# EasyEDA Pro project ProPrj_HPMDuino_DEV_2025-07-16.epro, schematic Schematic2
Board Name: JTAG转接板; Create Date: 2025-07-07; Page Name: P1; Project Name: HPMDuino_DEV; Schematic Name: Schematic2; Update Date: 2025-07-07; Drawed: Flose; Version: 1.0
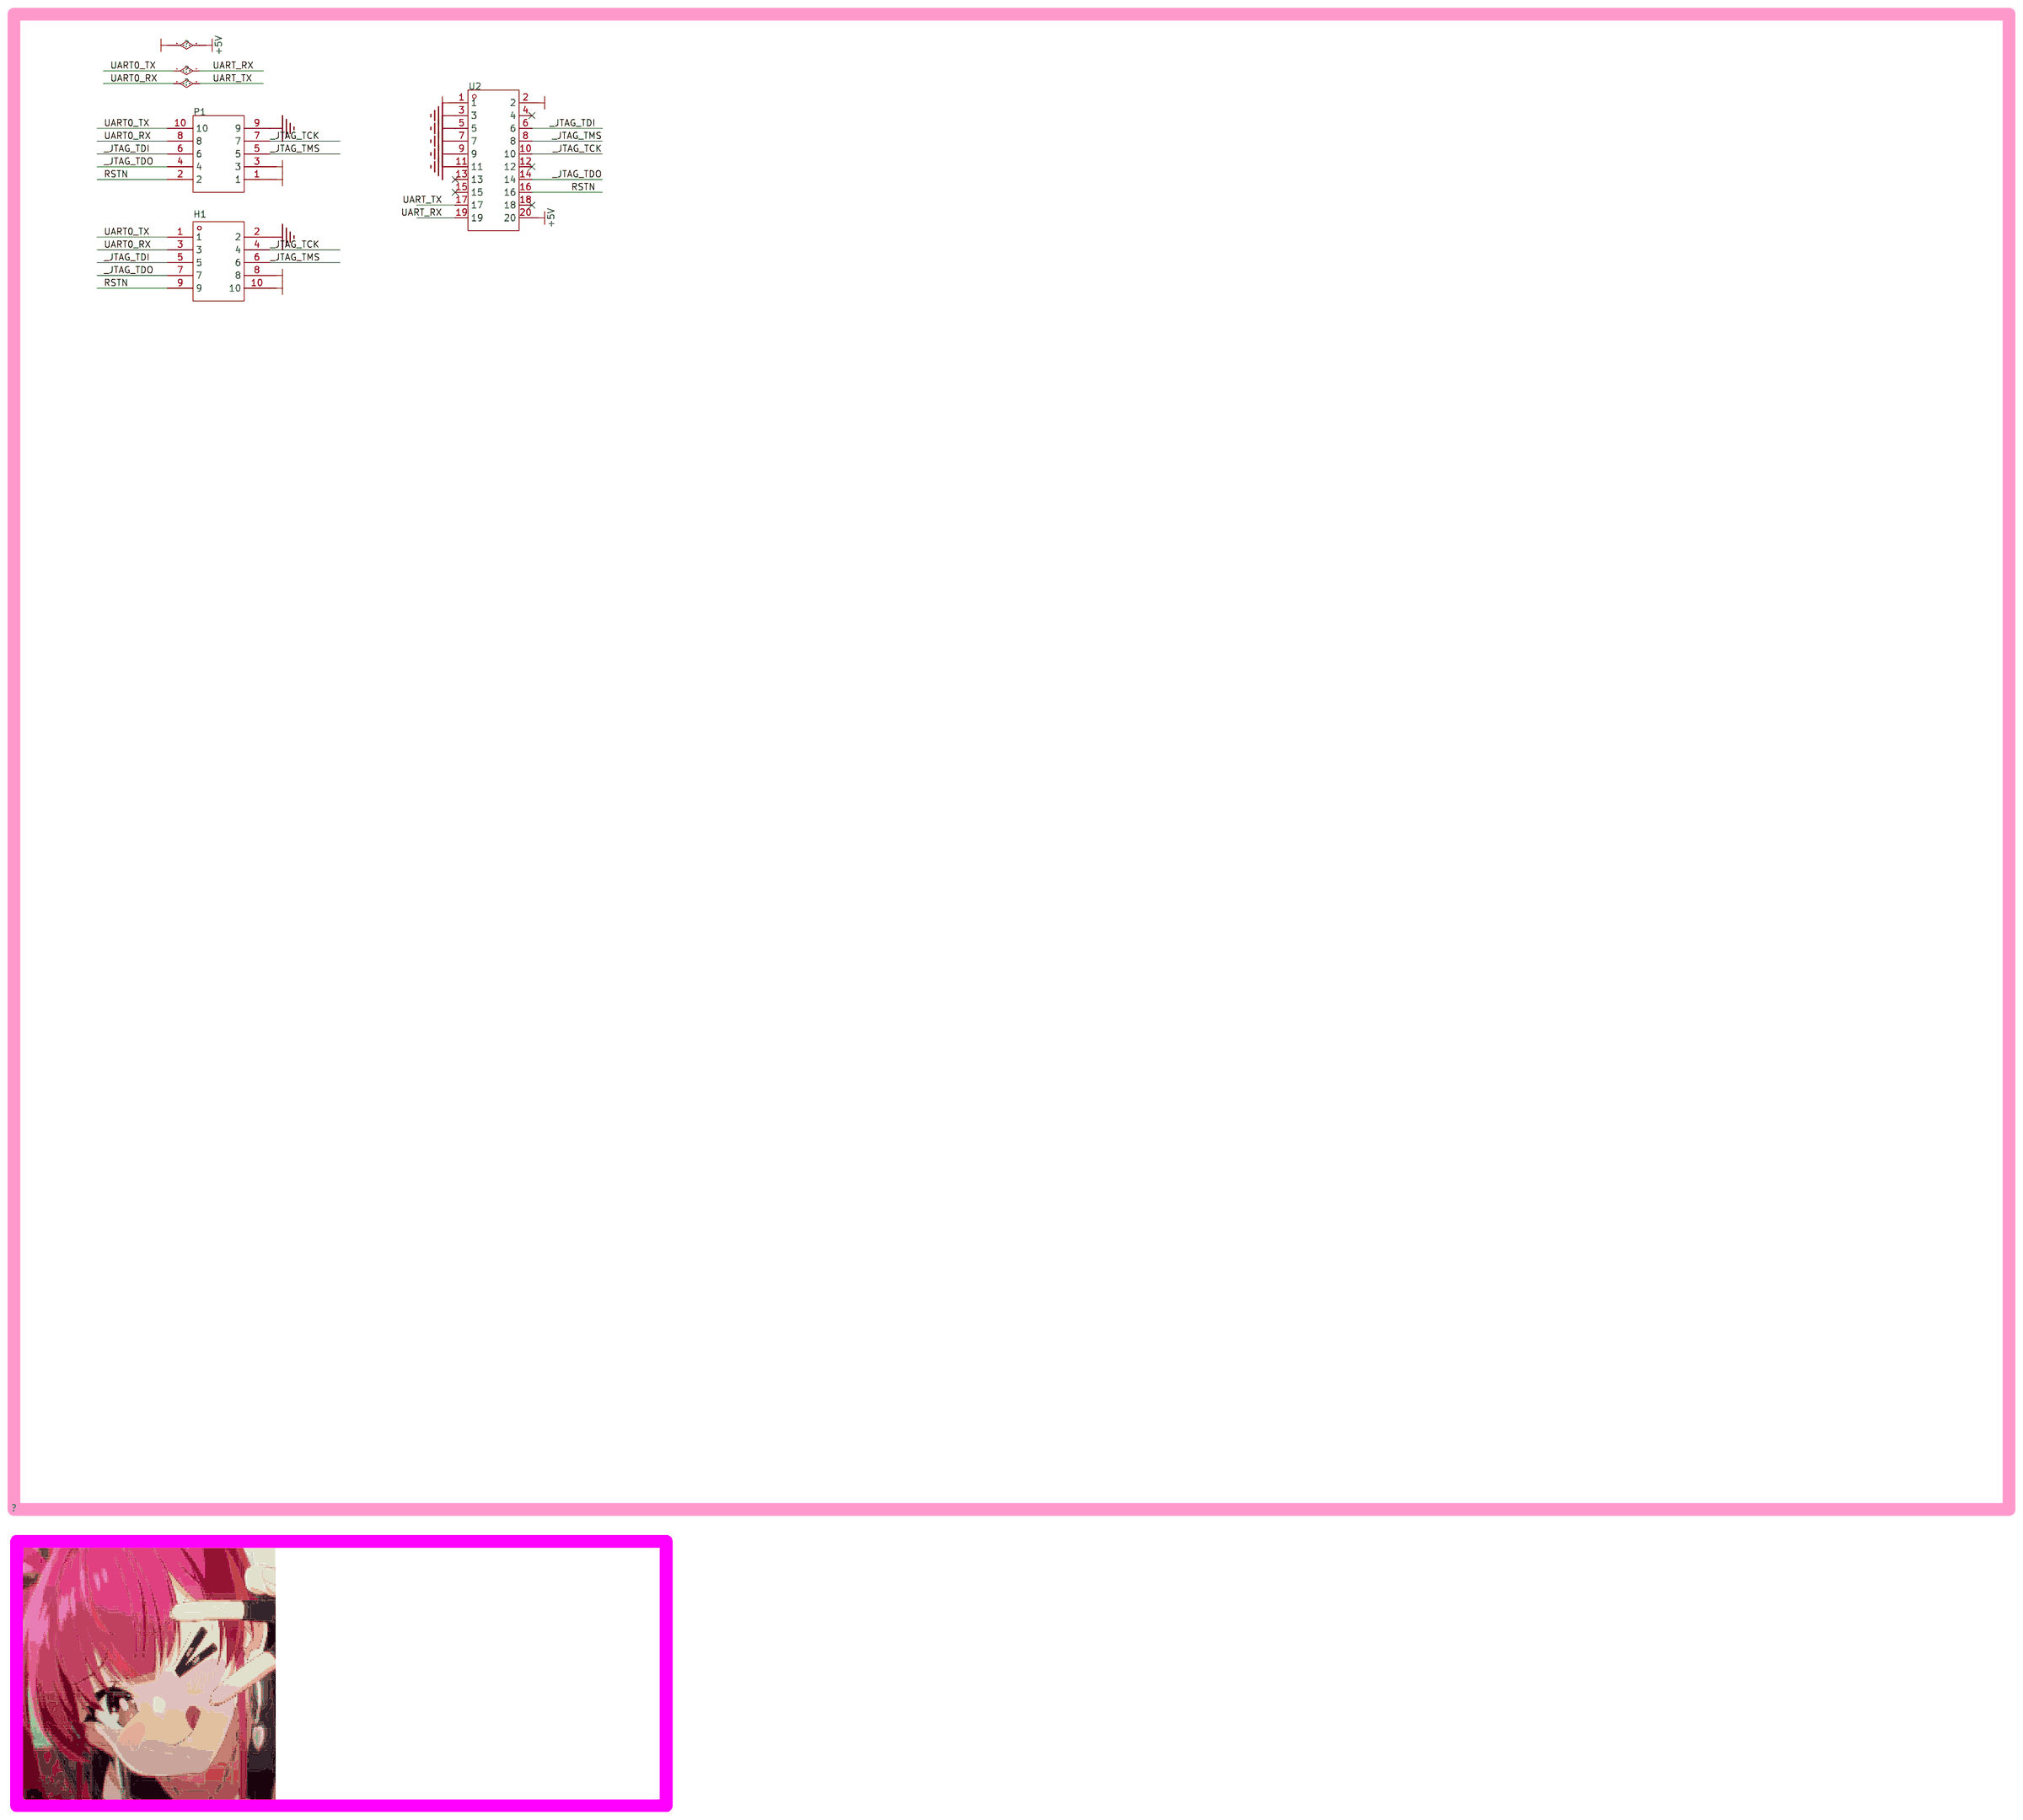
[diagram p1: schematic sheet]

## Parts
H1  -  [HDR-TH_10P-P2.54-V-M-R2-C5-S2.54]
P1  2.0-2*5P直简牛  [IDC-TH_10P-P2.00-V-R2-C5-S2.00]
U2  PM254-2-10-W-8.5  [HDR-TH_20P-P2.54-H-F-R2-C10-W8.5]

## Library data of the parts
H1 = HDR-M_2.54_2x5: Supplier Part: C124387; Supplier Footprint: 插件,P=2.54mm
P1 = 2.0-2*5P直简牛: 连接器类型:简牛座;间距:2mm;结构:2x5P;封装形式:直插;行距:2mm;排数:2;每排PIN数:5;触头材质:-;触头镀层:-;; LCSC Part Name: 2mm 2x5P 排数:2 每排P数:5; Supplier Part: C5661; Manufacturer: BOOMELE(博穆精密); Supplier Footprint: 插件,P=2mm; JLCPCB Part Class: 扩展库; Datasheet: https://atta.szlcsc.com/upload/public/pdf/source/20151118/1457707581337.pdf; Supplier: LCSC; Connector Type: 简牛座; Pitch: 2mm; Structure: 2x5P; Holder Type: 直插; Row Spacing: 2mm; Number of Rows: 2; Pin Number in each Row: 5
U2 = PM254-2-10-W-8.5: 插孔结构:2x10P;间距:2.54mm;行距:2.54mm;圆孔/方孔:方孔;安装类型:弯插;排数:双排;总孔位数:20P;额定电流:3A;额定电压:-;插孔方向:侧面;塑高:8.5mm;触头材质:铜合金;工作温度范围:-40℃~+105℃;焊接温度(最大值):260℃@5S;; LCSC Part Name: 2x10P 间距:2.54mm 弯插; Supplier Part: C2897430; Manufacturer: HCTL(华灿天禄); Supplier Footprint: 弯插,P=2.54mm; JLCPCB Part Class: Extended Part; Datasheet: https://atta.szlcsc.com/upload/public/pdf/source/20230609/283C0D22EF4E6FFE03D5A855876981ED.pdf; Supplier: LCSC; Holes Structure: 2x10P; Pitch: 2.54mm; Row Spacing: 2.54mm; Circular Hole / Square Hole: 方孔; Mounting Type: 弯插; Number of Rows: 双排; Number of Holes: 20P; Current Rating (Max): 3A; Holes Direction: 侧面; Insulation Height: 8.5mm; Contact Material: 铜合金; Operating Temperature Range: -40℃~+105℃; Soldering Temperature(Max): 260℃@5S

## Nets
+5V: H1.10 P1.1 U2.20
GND: H1.2 P1.9 U2.3 U2.5 U2.7 U2.9 U2.11
_JTAG_TCK: H1.4 P1.7 U2.10
_JTAG_TDI: H1.5 P1.6 U2.6
_JTAG_TDO: H1.7 P1.4 U2.14
_JTAG_TMS: H1.6 P1.5 U2.8
JTAG_VREF: H1.8 P1.3 U2.2
RSTN: H1.9 P1.2 U2.16
TVCC: U2.1
UART0_RX: H1.3 P1.8 U2.17
UART0_TX: H1.1 P1.10 U2.19

Not connected (* = marked no-connect by the designer): U2 4* 12* 13* 15* 18*
